# EAGLE design Nu_Preamp (EAGLE 7.6.0)
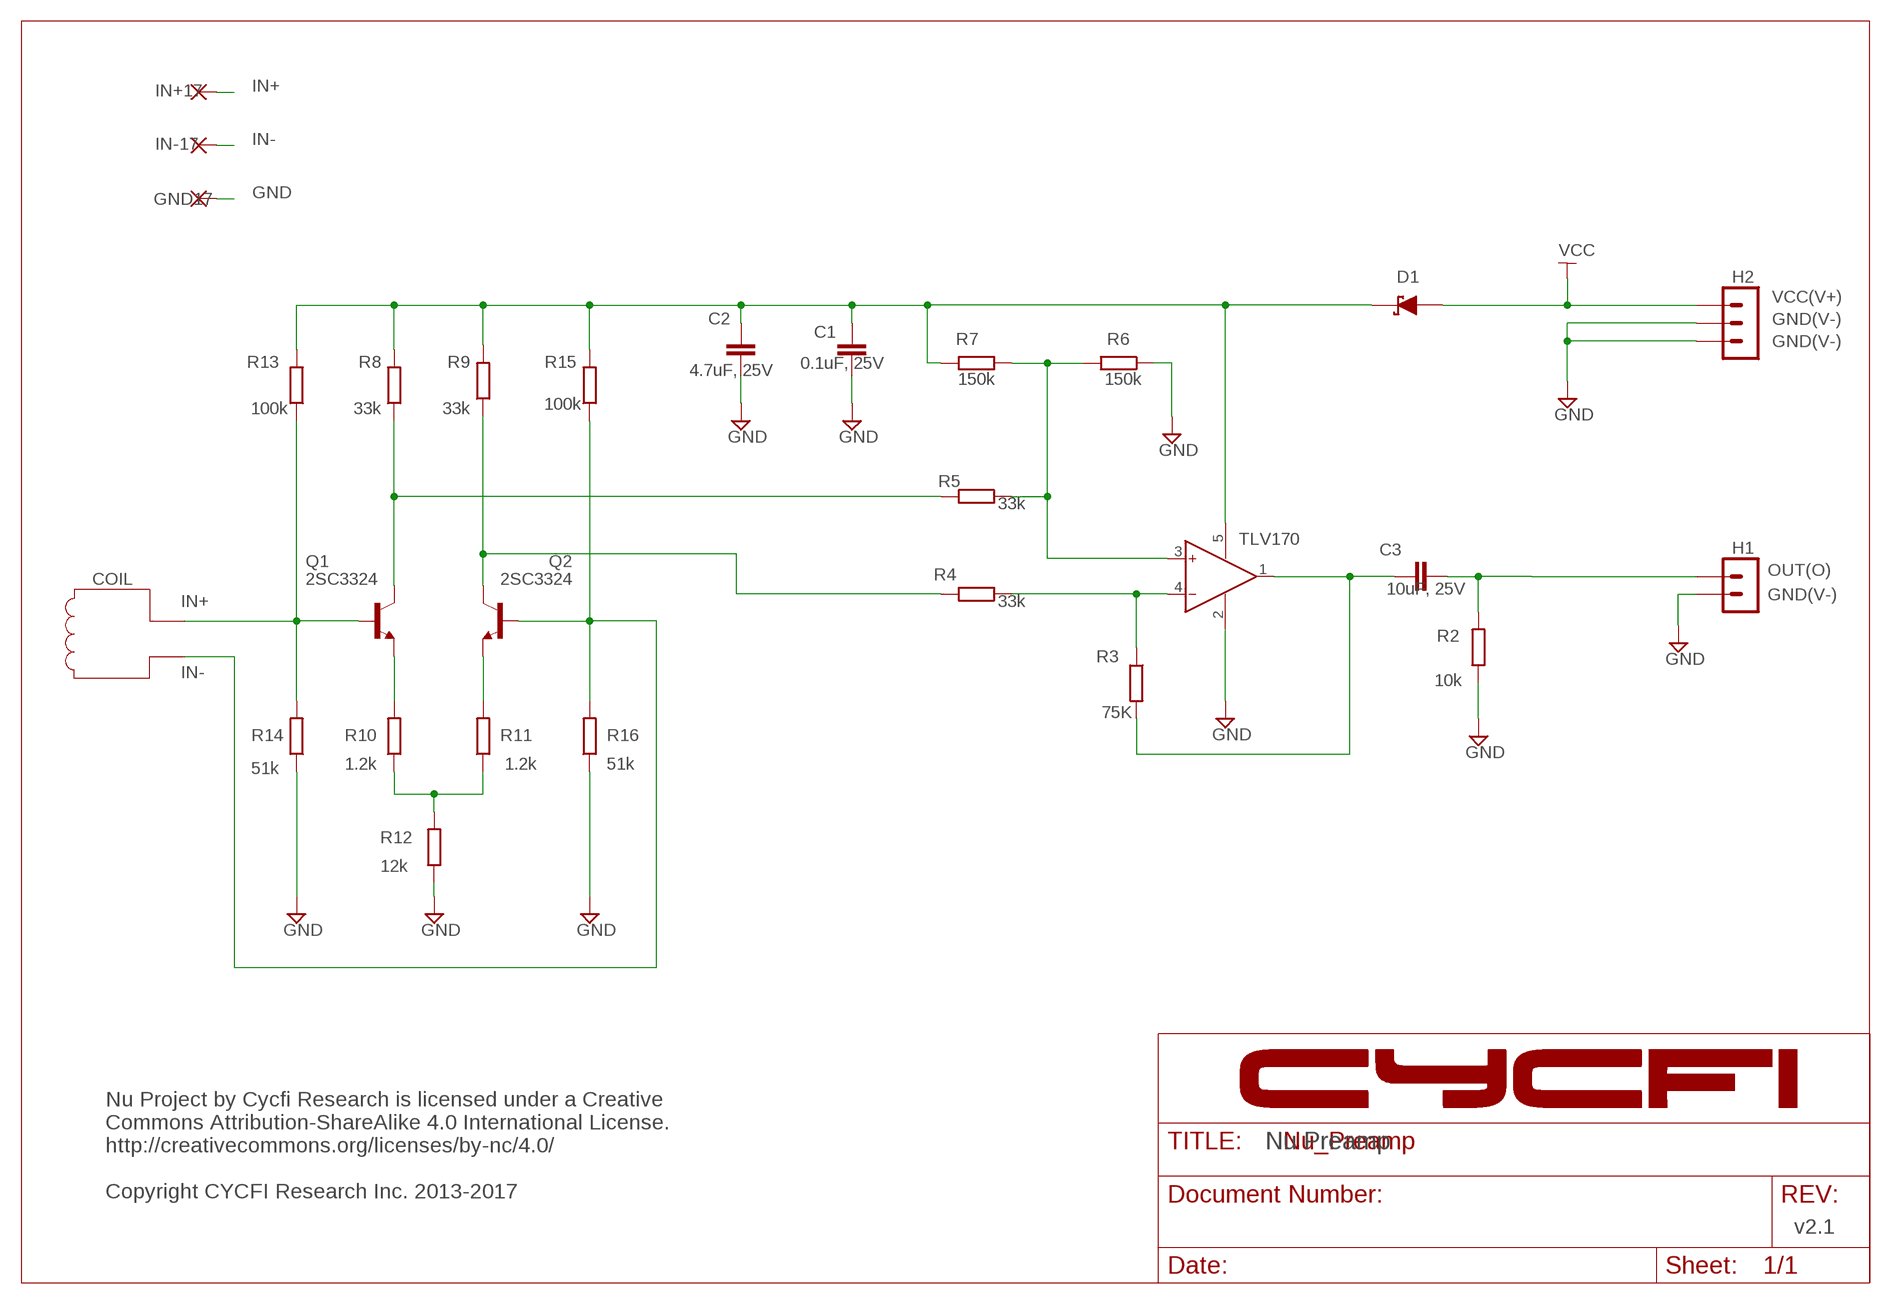
[diagram p0: schematic, sheet 1]

## Parts
C1  0.1uF, 25V  C-EUC0402  [C0402]
C2  4.7uF, 25V  C0603_NK  [C0603_NK]
C3  10uF, 25V  C0603_NK  [C0603_NK]
D1  D-SCHOTKKY_SOD323  [SOD323]
GND17  SMD2  [SMD1,27-2,54]
H1  2P-2MM-TH-MALE  [2P-2MM-TH]
H2  3P-2MM-TH-MALE  [3P-2MM-TH]
IN+17  SMD2  [SMD1,27-2,54]
IN-17  SMD2  [SMD1,27-2,54]
Q1  2SC3324  [SOT23]
Q2  2SC3324  [SOT23]
R2  10k  R-EU_R0402  [R0402]
R3  75K  R-EU_R0402  [R0402]
R4  33k  R-EU_R0402  [R0402]
R5  33k  R-EU_R0402  [R0402]
R6  150k  R-EU_R0402  [R0402]
R7  150k  R-EU_R0402  [R0402]
R8  33k  R-EU_R0402  [R0402]
R9  33k  R-EU_R0402  [R0402]
R10  1.2k  R-EU_R0402  [R0402]
R11  1.2k  R-EU_R0402  [R0402]
R12  12k  R-EU_R0402  [R0402]
R13  100k  R-EU_R0402  [R0402]
R14  51k  R-EU_R0402  [R0402]
R15  100k  R-EU_R0402  [R0402]
R16  51k  R-EU_R0402  [R0402]
U1  TLV170  [SOT23-5]

## Nets
GND: C1.2 C2.1 GND17.1(P) H1.P$2 H2.P$2 H2.P$3 R2.1 R6.1 R12.1 R14.1 R16.1 U1.2(V-)
IN+: IN+17.1(P) Q1.1(B) R13.1 R14.2
IN-: IN-17.1(P) Q2.1(B) R15.1 R16.2
N$1: C3.2 H1.P$1 R2.2
N$5: Q1.3(C) R5.2 R8.1
N$6: Q2.3(C) R4.2 R9.1
N$9: Q1.2(E) R10.2
N$10: Q2.2(E) R11.2
N$13: R10.1 R11.1 R12.2
N$14: R5.1 R6.2 R7.1 U1.3(IN+)
N$15: R3.1 R4.1 U1.4(IN-)
N$16: C3.1 R3.2 U1.1(OUT)
N$19: D1.1(A) H2.P$1
VCC1: C1.1 C2.2 D1.2(C) R7.2 R8.2 R9.2 R13.2 R15.2 U1.5(V+)

## Notes on the sheet
- VCC
- VCC(V+)
- GND(V-)
- GND(V-)
- OUT(O)
- COIL
- GND(V-)
- IN+
- IN-
- Nu Preamp
- Nu Project by Cycfi Research is licensed under a Creative 
  Commons Attribution-ShareAlike 4.0 International License. 
  http://creativecommons.org/licenses/by-nc/4.0/
  
  Copyright CYCFI Research Inc. 2013-2017
- v2.1

## Library data of the parts
C1 = rcl:C-EU: CAPACITOR, European symbol
C2 C3 = rcl:C0603_NK
D1 = CYCFI_semicon:D-SCHOTKKY_SOD323
GND17 IN+17 IN-17 = wirepad:SMD2: SMD PAD
H1 = CYCFI_Con:2P-2MM-TH-MALE
H2 = CYCFI_Con:3P-2MM-TH-MALE
Q1 Q2 = CYCFI_semicon:2SC3324
R2-R16 = rcl:R-EU_: RESISTOR, European symbol
U1 = CYCFI_semicon:TLV170

## Board
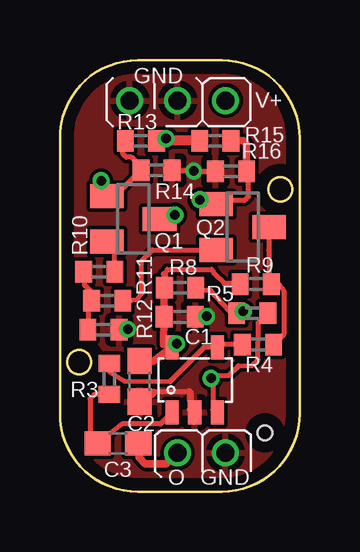
[diagram p1: board, top side]
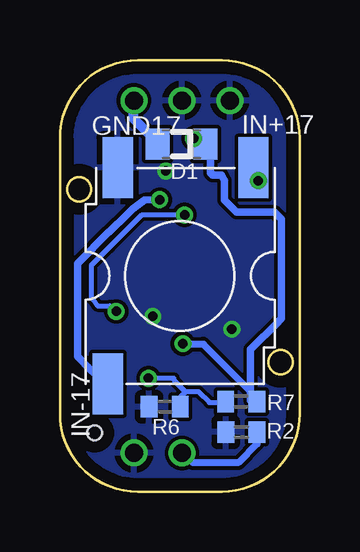
[diagram p2: board, bottom side, seen from below]

Size 10 x 18.01 mm. Coordinates in mm from the lower left corner, seen from the top.
Outline: 0,14.76 0,3.26 arc90 3.25,0.01 6.75,0.01 arc90 10,3.26 10,14.76
Outline: 3.25,18.01 6.75,18.01
Outline: 3.25,0 6.75,0 arc90 10,3.25 10,14.75 arc90 6.75,18 3.25,18 arc90 0,14.75 0,3.25 arc90 3.25,0
Outline: circle at 0.8,5.41 radius 0.5
Outline: circle at 9.2,12.61 radius 0.5
Copper layers (1*16): Top 0.035mm / dielectric 1.6mm / Bottom 0.035mm
Design rules "Elecrow_2-layer_PCB_eagle_rule": minimum track width 6mil, minimum drill 12mil, track to track 6mil, track to pad 8mil, pad to pad 12mil, via to via 12mil, smd to smd 0mil, copper to edge 20mil, drill to drill 10mil, minimum pad ring 6mil, minimum via ring 6mil, stop-mask expansion 0mil, vias tented up to drill 100mil, thermal gap 10mil
Holes 0.6 mm at 8.55,2.46

### Footprints (pad centres in the part's own frame; a part is rotated, then mirrored left to right if it is on the bottom)
C0402 = smd 0.7 x 0.9: 1 -0.65,0; 2 0.65,0
C0603_NK = smd 1.1 x 1: 1 -0.85,0; 2 0.85,0
SOD323 = smd 1 x 1.3: 1 -1,0; 2 1,0
SMD1,27-2,54 = smd 1.27 x 2.54: 1 0,0
2P-2MM-TH = drill 0.75: P$1 -1,0; P$2 1,0
3P-2MM-TH = drill 0.75: P$1 -2,0; P$2 0,0; P$3 2,0
SOT23 = smd 1 x 1.4: 1 -0.95,-1.1; 2 0.95,-1.1; 3 0,1.1
R0402 = smd 0.7 x 0.9: 1 -0.65,0; 2 0.65,0
SOT23-5 = smd 0.55 x 1: 1 -0.95,-1.35; 2 0,-1.35; 3 0.95,-1.35; 4 0.95,1.35; 5 -0.95,1.35

### Placement (x,y rotation side)
C1  5,7.29 0 top
C2  3.33,4.61 90 top
C3  2.42,2.01 0 top
D1  4.93,14.5 0 bottom
GND17  7.59,13.52 0 bottom
H1  5.91,1.62 0 top
H2  4.92,16.32 180 top
IN+17  1.93,13.52 0 bottom
IN-17  8,4.5 0 bottom
Q1  3.06,11.38 270 top
Q2  7.63,11.04 270 top
R2  2.43,2.49 0 bottom
R3  2.06,4.71 270 top
R4  8.27,6.14 0 top
R5  8.02,7.45 180 top
R6  5.63,3.55 0 bottom
R7  2.43,3.77 0 bottom
R8  5.02,8.51 180 top
R9  8.17,8.66 180 top
R10  1.64,9.17 0 top
R11  1.98,7.97 0 top
R12  1.82,6.76 180 top
R13  3.38,14.64 0 top
R14  4.03,13.41 180 top
R15  6.48,14.64 180 top
R16  7.14,13.36 0 top
U1  5.62,4.66 0 top

### Tracks (layer width: path | path; a pad name or v marks a point on that pad's centre or on a via)
GND  (via drill 0.4)
  Top 0.203: 3.85,4.14 3.91,4.18 5.4,4.18 | R16.1 6.49,13.38 v5.58,13.38 4.68,13.38 R14.1 | v2.83,6.78 2.47,6.78 R12.1 | v6.12,7.32 5.65,7.32 C1.2
  Top 0.3: C2.1 3.5,3.74 3.8,4.04 3.82,4.04 3.92,4.15 3.85,4.14 | 5.4,4.18 5.43,4.11 5.44,3.43 U1.2
  pour Top: -0.07,0 10.03,0 10.03,8 10.03,18.1 4.83,18.1 -0.07,18.1
  pour Bottom: -0.07,0 10.03,0 10.03,1.9 10.03,18.1 5.23,18.1 -0.07,18.1
IN+  (via drill 0.4)
  Top 0.203: R13.1 2.62,14.63 2.62,14.11 2.77,13.96 2.99,13.96 3.36,13.58 R14.2 2.31,12.33 Q1.1 1.96,12.66 1.72,12.9 v1.72,12.97
  Bottom 0.203: v1.72,12.97 1.72,13.51 IN+17.1
IN-  (via drill 0.4)
  Top 0.203: v5.84,12.18 v5.83,12.18 Q2.1 6.48,12.17 7.71,12.17 7.73,12.17 7.87,12.31 7.87,13.28 R16.2
  Top 0.315: R15.1 7.65,14.64 7.78,14.5 7.78,13.48 R16.2
  Bottom 0.315: v5.84,12.18 6.46,12.16 6.97,11.79 7.17,11.58 7.95,10.83 7.96,10.83 9.26,9.53 9.26,6.22 9.25,6.21 9.25,5.63 8.71,5.09 8.53,4.92 IN-17.1
N$1
  Top 0.315: C3.2 3.3,1.43 3.56,1.17 4.42,1.17 H1.P$1
  Bottom 0.3: R2.2 1.78,1.99 2.56,1.21 4.45,1.21 H1.P$1
N$5  (via drill 0.4)
  Top 0.203: R8.1 5.66,8.4 6.28,8.4 7.09,7.51 7.3,7.51 R5.2 7.45,7.52 v7.65,7.52 7.41,7.76 | Q1.3 3.96,11.54 v4.8,11.55
  Bottom 0.203: v7.65,7.52 7.91,7.75 8.43,7.75 8.64,8.03 8.69,8.08 8.69,9.45 8.06,10.08 7.94,10.18 6.59,11.53 v4.8,11.55
N$6
  Top 0.203: Q2.3 8.71,10.08 8.72,9.79 8.72,8.88 R9.1 9.12,8.68 9.34,8.38 9.34,6.56 R4.2
N$9
  Top 0.203: R10.2 2.28,9.94 Q1.2
N$10
  Top 0.203: R11.2 3.22,8.01 3.41,8.27 3.41,9.64 3.86,10.09 Q2.2
N$13
  Top 0.203: 1.31,6.71 R12.2 1.17,7.81 R11.1 1.32,8.34 1.03,8.62 1.03,9.11 R10.1 1.17,8.89
N$14  (via drill 0.4)
  Top 0.2: 8.27,5.5 8.27,7.02
  Top 0.203: 6.38,4.64 6.58,4.84 7,4.84 7.44,5.26 8.02,5.26 8.27,5.5 | 6.38,4.64 6.38,3.42 U1.3 | v6.31,4.73 6.29,4.73 6.38,4.64 | 8.27,7.02 8.27,7.05 R5.1
  Bottom 0.203: 4.76,4.17 4.21,4.17 3.76,3.72 3.11,3.72 3.11,3.74 R7.1 | v6.31,4.73 5.26,4.73 5.26,4.67 4.76,4.17 | 4.76,4.17 4.93,4 4.93,3.55 R6.2
N$15
  Top 0.025: R3.1 2.09,5.36 2.09,5.29
  Top 0.195: 4.6,4.6 2.69,4.61
  Top 0.203: 6.43,6.09 U1.4 | U1.4 6,6.03 4.6,4.6 | 2.69,4.61 2.09,4.98 2.09,5.29 | R4.1 6.7,6.14 U1.4
N$16
  Top 0.203: U1.1 4.19,2.83 2.6,2.83 C3.1 1.25,2.3 1.25,3.89 1.43,4.02 1.43,4.06 R3.2
N$19
  Bottom 0.025: D1.1 5.9,14.5 5.9,14.53
  Bottom 0.406: 5.9,14.53 6.92,15.55 6.92,16.31 H2.P$1
VCC1  (via drill 0.4)
  Top 0.203: 4.36,9.06 4.38,9.06 4.49,9.27 6.33,9.27 6.39,9.19 6.39,9.17 6.88,8.68
  Top 0.25: R9.2 6.88,8.68
  Top 0.3: 4.36,9.06 R8.2
  Top 0.315: U1.5 v4.87,6.17 | C2.2 3.87,5.44 v4.87,6.17 | R8.2 4.35,8.39 C1.1 4.33,6.15 v4.87,6.17
  Top 0.406: R13.2 4.02,14.73 v4.43,14.73 4.52,14.64 R15.2
  Bottom 0.025: R13.2 3.93,14.64 D1.2
  Bottom 0.203: R7.2 2.06,3.77 2.06,3.81 | 2.05,5.93 2.05,3.93 2.03,3.9
  Bottom 0.3: 2.03,3.9 2.03,4.17 4.01,6.15
  Bottom 0.305: 2.06,3.81 2.05,5.93 0.89,7.09 0.89,7.1 0.76,7.23 0.76,11.37 1.06,11.66 2.63,11.66 3.14,12.17 3.14,12.99 3.26,13.21 3.64,13.21 3.72,13.28 3.72,14.4
  Bottom 0.315: v4.87,6.17 4.01,6.15
  Bottom 0.406: 3.72,14.4 3.79,14.4 R13.2 4.33,14.64 v4.43,14.73

### Text on the board
tNames: GND | V+ | O | GND
BlindViaText: FillOverPAD:GND:9:57 | FillOverPAD:GND:47:57 | FillOverPAD:GND:51:57 | FillOverPAD:GND:43:57 | FillOverPAD:GND:2:57 | FillOverPAD:GND:3:57 | FillOverPAD:GND:31:57 | FillOverPAD:GND:23:57 | FillOverPAD:GND:54:57